# EAGLE schematic 4fachsensor (EAGLE 7.2.0)
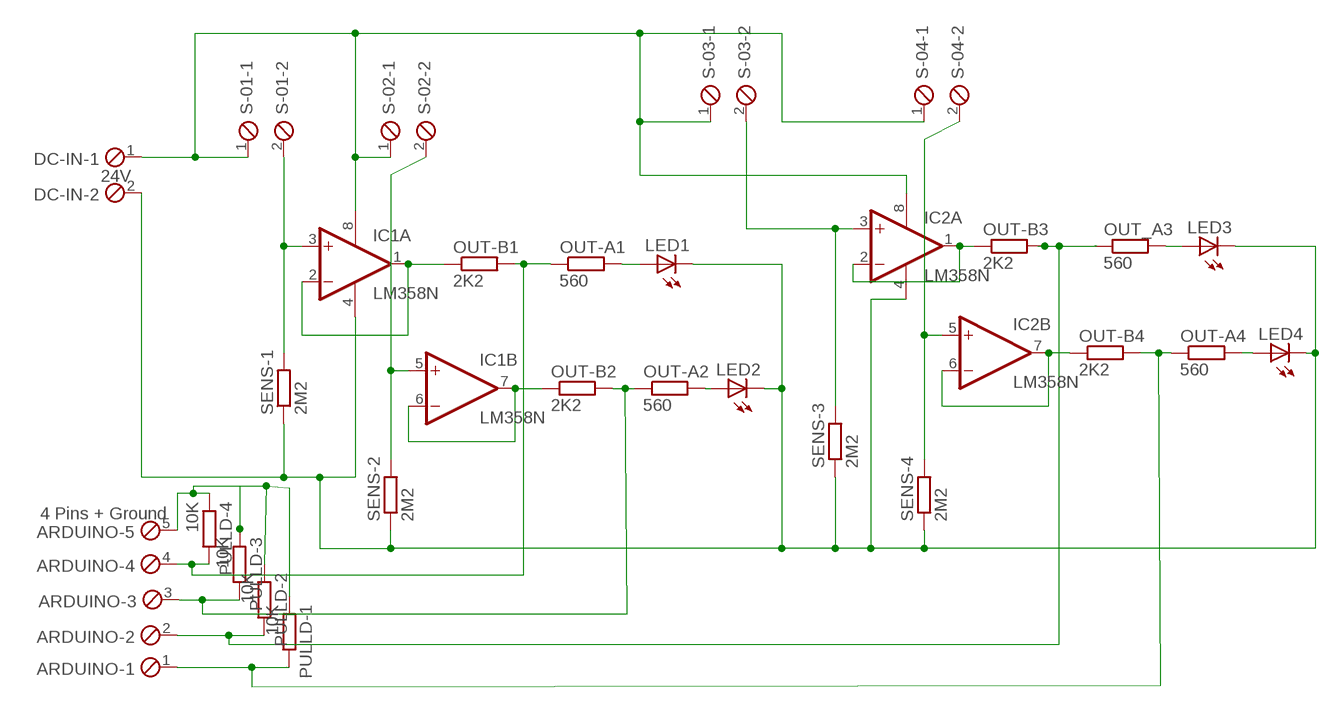
[diagram p0: schematic, sheet 1]

## Parts
ARDUINO  4 Pins + Ground  MPT5  [5POL254]
DC-IN  24V  MPT2  [2POL254]
IC1  LM358N  [DIL08]
IC2  LM358N  [DIL08]
LED1  LED5MM  [LED5MM]
LED2  LED5MM  [LED5MM]
LED3  LED5MM  [LED5MM]
LED4  LED5MM  [LED5MM]
OUT-A1  560  R-EU_0207/7  [0207/7]
OUT-A2  560  R-EU_0207/7  [0207/7]
OUT-A4  560  R-EU_0207/7  [0207/7]
OUT-B1  2K2  R-EU_0207/7  [0207/7]
OUT-B2  2K2  R-EU_0207/7  [0207/7]
OUT-B3  2K2  R-EU_0207/7  [0207/7]
OUT-B4  2K2  R-EU_0207/7  [0207/7]
OUT_A3  560  R-EU_0207/7  [0207/7]
PULLD-1  10K  R-EU_0207/7  [0207/7]
PULLD-2  10K  R-EU_0207/7  [0207/7]
PULLD-3  10K  R-EU_0207/7  [0207/7]
PULLD-4  10K  R-EU_0207/7  [0207/7]
S-01  MPT2  [2POL254]
S-02  MPT2  [2POL254]
S-03  MPT2  [2POL254]
S-04  MPT2  [2POL254]
SENS-1  2M2  R-EU_0207/7  [0207/7]
SENS-2  2M2  R-EU_0207/7  [0207/7]
SENS-3  2M2  R-EU_0207/7  [0207/7]
SENS-4  2M2  R-EU_0207/7  [0207/7]

## Nets
N$1: DC-IN.1 IC1.8(P:V+) IC2.8(P:V+) S-01.1 S-02.1 S-03.1 S-04.1
N$2: IC1.3(A:+IN) S-01.2 SENS-1.2
N$3: DC-IN.2 IC1.4(P:V-) IC2.4(P:V-) LED1.K(C) LED2.K(C) LED3.K(C) LED4.K(C) SENS-1.1 SENS-2.1 SENS-3.1 SENS-4.1
N$4: IC1.1(A:OUT) IC1.2(A:-IN) OUT-B1.1
N$5: LED1.A OUT-A1.2
N$7: IC1.6(B:-IN) IC1.7(B:OUT) OUT-B2.1
N$8: IC1.5(B:+IN) S-02.2 SENS-2.2
N$10: LED2.A OUT-A2.2
N$11: LED4.A OUT-A4.2
N$12: IC2.3(A:+IN) S-03.2 SENS-3.2
N$13: IC2.5(B:+IN) S-04.2 SENS-4.2
N$15: ARDUINO.1 OUT-A4.1 OUT-B4.2 PULLD-1.2
N$16: ARDUINO.2 OUT-B3.2 OUT_A3.1 PULLD-2.2
N$17: IC2.1(A:OUT) IC2.2(A:-IN) OUT-B3.1
N$18: IC2.6(B:-IN) IC2.7(B:OUT) OUT-B4.1
N$19: ARDUINO.3 OUT-A2.1 OUT-B2.2 PULLD-3.2
N$20: LED3.A OUT_A3.2
N$21: ARDUINO.4 OUT-A1.1 OUT-B1.2 PULLD-4.2
N$22: ARDUINO.5 PULLD-1.1 PULLD-2.1 PULLD-3.1 PULLD-4.1

## Library data of the parts
ARDUINO = con-phoenix-254:MPT5: PHOENIX CONNECTOR; OC_FARNELL: unknown; OC_NEWARK: unknown
DC-IN S-01-S-04 = con-phoenix-254:MPT2: PHOENIX CONNECTOR; OC_FARNELL: unknown; OC_NEWARK: unknown
IC1 IC2 = linear:LM358: OP AMP also LM158; LM258; LM2904 Source: http://cache.national.com/ds/LM/LM158.pdf
LED1-LED4 = led:LED: LED OSRAM: - CHIPLED LG R971, LG N971, LY N971, LG Q971, LY Q971, LO R971, LY R971 LH N974, LH R974 LS Q976, LO Q976, LY Q976 LO Q996 - Hyper CHIPLED LW Q18S LB Q993, LB Q99A, LB R99A - SideLED LS A670, LO A670, LY A670, LG A670, LP A670 LB A673, LV A673, LT A673, LW A673 LH A674 LY A675 LS A676, LA A676, LO A676, LY A676, LW A676 LS A679, LY A679, LG A679 - Hyper Micro SIDELED® LS Y876, LA Y876, LO Y876, LY Y876 LT Y87S - SmartLED LW L88C, LW L88S LB L89C, LB L89S, LG L890 LS L89K, LO L89K, LY L89K LS L896, LA L896, LO L896, LY L896 - TOPLED LS T670, LO T670, LY T670, LG T670, LP T670 LSG T670, LSP T670, LSY T670, LOP T670, LYG T670 LG T671, LOG T671, LSG T671 LB T673, LV T673, LT T673, LW T673 LH T674 LS T676, LA T676, LO T676, LY T676, LB T676, LH T676, LSB T676, LW T676 LB T67C, LV T67C, LT T67C, LS T67K, LO T67K, LY T67K, LW E67C LS E67B, LA E67B, LO E67B, LY E67B, LB E67C, LV E67C, LT E67C LW T67C LS T679, LY T679, LG T679 LS T770, LO T770, LY T770, LG T770, LP T770 LB T773, LV T773, LT T773, LW T773 LH T774 LS E675, LA E675, LY E675, LS T675 LS T776, LA T776, LO T776, LY T776, LB T776 LHGB T686 LT T68C, LB T68C - Hyper Mini TOPLED® LB M676 - Mini TOPLED Santana® LG M470 LS M47K, LO M47K, LY M47K Source: http://www.osram.convergy.de LUXEON: - LUMILED® LXK2-PW12-R00, LXK2-PW12-S00, LXK2-PW14-U00, LXK2-PW14-V00 LXK2-PM12-R00, LXK2-PM12-S00, LXK2-PM14-U00 LXK2-PE12-Q00, LXK2-PE12-R00, LXK2-PE12-S00, LXK2-PE14-T00, LXK2-PE14-U00 LXK2-PB12-K00, LXK2-PB12-L00, LXK2-PB12-M00, LXK2-PB14-N00, LXK2-PB14-P00, LXK2-PB14-Q00 LXK2-PR12-L00, LXK2-PR12-M00, LXK2-PR14-Q00, LXK2-PR14-R00 LXK2-PD12-Q00, LXK2-PD12-R00, LXK2-PD12-S00 LXK2-PH12-R00, LXK2-PH12-S00 LXK2-PL12-P00, LXK2-PL12-Q00, LXK2-PL12-R00 Source: www.luxeon.com KINGBRIGHT: KA-3528ASYC Source: www.kingbright.com
OUT-A1 OUT-A2 OUT-A4 OUT-B1-OUT-B4 OUT_A3 PULLD-1-PULLD-4 SENS-1-SENS-4 = resistor:R-EU_: RESISTOR, European symbol